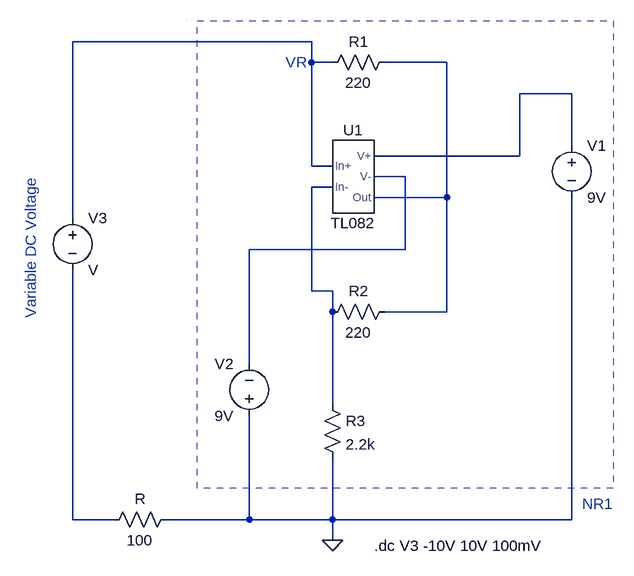
[diagram p0: schematic NR1.asc]
NR1.asc, the LTspice schematic file:
Version 4
SHEET 1 892 816
WIRE 416 -48 48 -48
WIRE 416 -16 416 -48
WIRE 448 -16 416 -16
WIRE 624 -16 528 -16
WIRE 816 32 736 32
WIRE 816 112 816 32
WIRE 736 128 736 32
WIRE 736 128 512 128
WIRE 416 144 416 -16
WIRE 448 144 416 144
WIRE 560 160 512 160
WIRE 448 176 416 176
WIRE 624 192 624 -16
WIRE 624 192 512 192
WIRE 48 224 48 -48
WIRE 560 272 560 160
WIRE 560 272 320 272
WIRE 416 336 416 176
WIRE 448 336 416 336
WIRE 448 368 448 336
WIRE 624 368 624 192
WIRE 624 368 528 368
WIRE 320 448 320 272
WIRE 448 512 448 368
WIRE 48 688 48 304
WIRE 112 688 48 688
WIRE 320 688 320 528
WIRE 320 688 192 688
WIRE 448 688 448 592
WIRE 448 688 320 688
WIRE 816 688 816 192
WIRE 816 688 448 688
WIRE 448 720 448 688
FLAG 448 720 0
SYMBOL TL082 480 160 R0
SYMATTR InstName U1
SYMBOL res 544 -32 R90
WINDOW 0 0 56 VBottom 2
WINDOW 3 32 56 VTop 2
SYMATTR InstName R1
SYMATTR Value 220
SYMATTR SpiceLine tol=5
SYMBOL res 544 352 R90
WINDOW 0 0 56 VBottom 2
WINDOW 3 32 56 VTop 2
SYMATTR InstName R2
SYMATTR Value 220
SYMATTR SpiceLine tol=5
SYMBOL res 432 496 R0
SYMATTR InstName R3
SYMATTR Value 2.2k
SYMATTR SpiceLine tol=5
SYMBOL voltage 320 544 R180
WINDOW 0 24 96 Left 2
WINDOW 3 24 16 Left 2
WINDOW 123 0 0 Left 0
WINDOW 39 0 0 Left 0
SYMATTR InstName V2
SYMATTR Value 9V
SYMBOL voltage 816 96 R0
WINDOW 123 0 0 Left 0
WINDOW 39 0 0 Left 0
SYMATTR InstName V1
SYMATTR Value 9V
SYMBOL voltage 48 208 R0
SYMATTR InstName V3
SYMBOL res 208 672 R90
WINDOW 0 0 56 VBottom 2
WINDOW 3 32 56 VTop 2
SYMATTR InstName R
SYMATTR Value 100
SYMATTR SpiceLine tol=5
TEXT 512 728 Left 2 !.dc V3 -10V 10V 100mV
TEXT 832 664 Left 2 ;NR1
TEXT 376 -16 Left 2 ;VR
TEXT -16 160 VRight 2 ;Variable DC Voltage
RECTANGLE Normal 224 -80 224 -80 2
RECTANGLE Normal 880 640 240 -80 2

The netlist it stands for:
* NR1.asc
XU1 N001 N005 N003 N004 N002 TL082  ; pins In+ In- V+ V- Out
R1 N002 N001 220 tol=5
R2 N002 N005 220 tol=5
R3 N005 0 2.2k tol=5
V2 0 N004 9V
V1 N003 0 9V
V3 N001 N006 V
R 0 N006 100 tol=5
.dc V3 -10V 10V 100mV
* NR1
* VR
* Variable DC Voltage
.lib TL082.sub
.backanno
.end

* Results of the author's LTspice run, read from the files saved beside the schematic
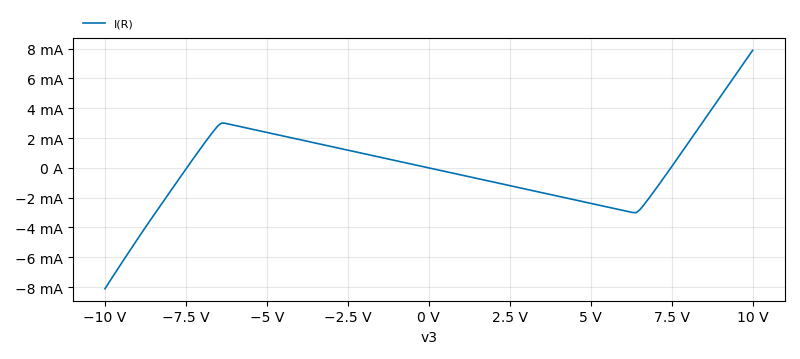
[diagram p1: DC transfer characteristic of NR1.asc, plotted from the saved traces]
* DC transfer characteristic, 1 run:
*   I(R): -8.115 mA at v3=-10 V, 7.888 mA at v3=10 V, min -8.115 mA, max 7.888 mA